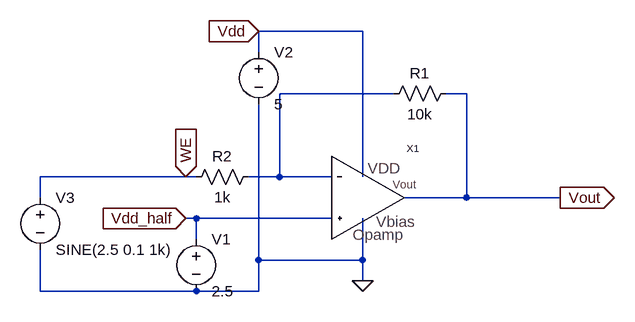
[diagram p0: schematic test.asc]
test.asc, the LTspice schematic file:
Version 4
SHEET 1 880 680
WIRE 144 -64 -16 -64
WIRE -16 -32 -16 -64
WIRE 192 32 16 32
WIRE 304 32 272 32
WIRE -128 160 -352 160
WIRE -112 160 -128 160
WIRE 16 160 16 32
WIRE 16 160 -32 160
WIRE 96 160 16 160
WIRE 144 160 144 -64
WIRE -352 192 -352 160
WIRE 304 192 304 32
WIRE 304 192 208 192
WIRE 448 192 304 192
WIRE -112 224 -128 224
WIRE 96 224 -112 224
WIRE -112 256 -112 224
WIRE -16 288 -16 48
WIRE 144 288 144 224
WIRE 144 288 -16 288
WIRE 144 320 144 288
WIRE -352 336 -352 272
WIRE -112 336 -352 336
WIRE -16 336 -16 288
WIRE -16 336 -112 336
FLAG -128 160 WE
IOPIN -128 160 In
FLAG -16 -64 Vdd
IOPIN -16 -64 In
FLAG -128 224 Vdd_half
IOPIN -128 224 In
FLAG 448 192 Vout
IOPIN 448 192 Out
FLAG 144 320 0
SYMBOL Opamp3ureiauto 176 192 R0
SYMATTR InstName X1
SYMBOL res 288 16 R90
WINDOW 0 0 56 VBottom 2
WINDOW 3 32 56 VTop 2
SYMATTR InstName R1
SYMATTR Value 10k
SYMBOL voltage -112 240 R0
SYMATTR InstName V1
SYMATTR Value 2.5
SYMBOL voltage -16 -48 R0
SYMATTR InstName V2
SYMATTR Value 5
SYMBOL res -16 144 R90
WINDOW 0 0 56 VBottom 2
WINDOW 3 32 56 VTop 2
SYMATTR InstName R2
SYMATTR Value 1k
SYMBOL voltage -352 176 R0
WINDOW 123 0 0 Left 0
WINDOW 39 0 0 Left 0
SYMATTR InstName V3
SYMATTR Value SINE(2.5 0.1 1k)

The netlist it stands for:
* test.asc
XX1 N001 Vdd_half Vout Vdd 0 Opamp3ureiauto  ; pins Vinm Vinp Vout VDD Vbias
R1 Vout N001 10k
V1 Vdd_half 0 2.5
V2 Vdd 0 5
R2 N001 WE 1k
V3 WE 0 SINE(2.5 0.1 1k)
.backanno
.end